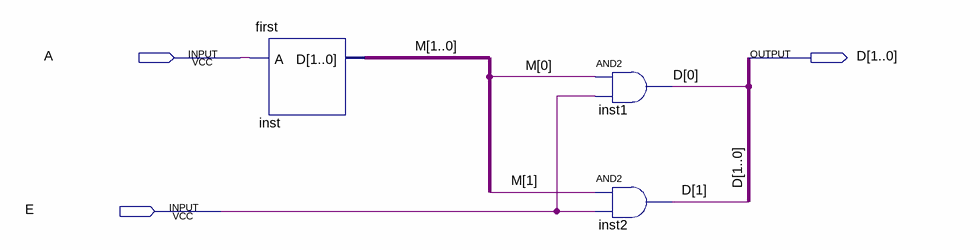
[diagram p0: schematic sheet]
// Quartus schematic first2.bdf as structural Verilog: 3 symbols, 3 pins
module first2 (
  input  A,
  input  E,
  output [1:0] D
);

  wire [1:0] M;

  first inst (.A(A), .D(M));
  and inst1 (D[0], M[0], E);
  and inst2 (D[1], M[1], E);
endmodule
